# EAGLE design microcontroller_r0 (EAGLE 6.5.0)
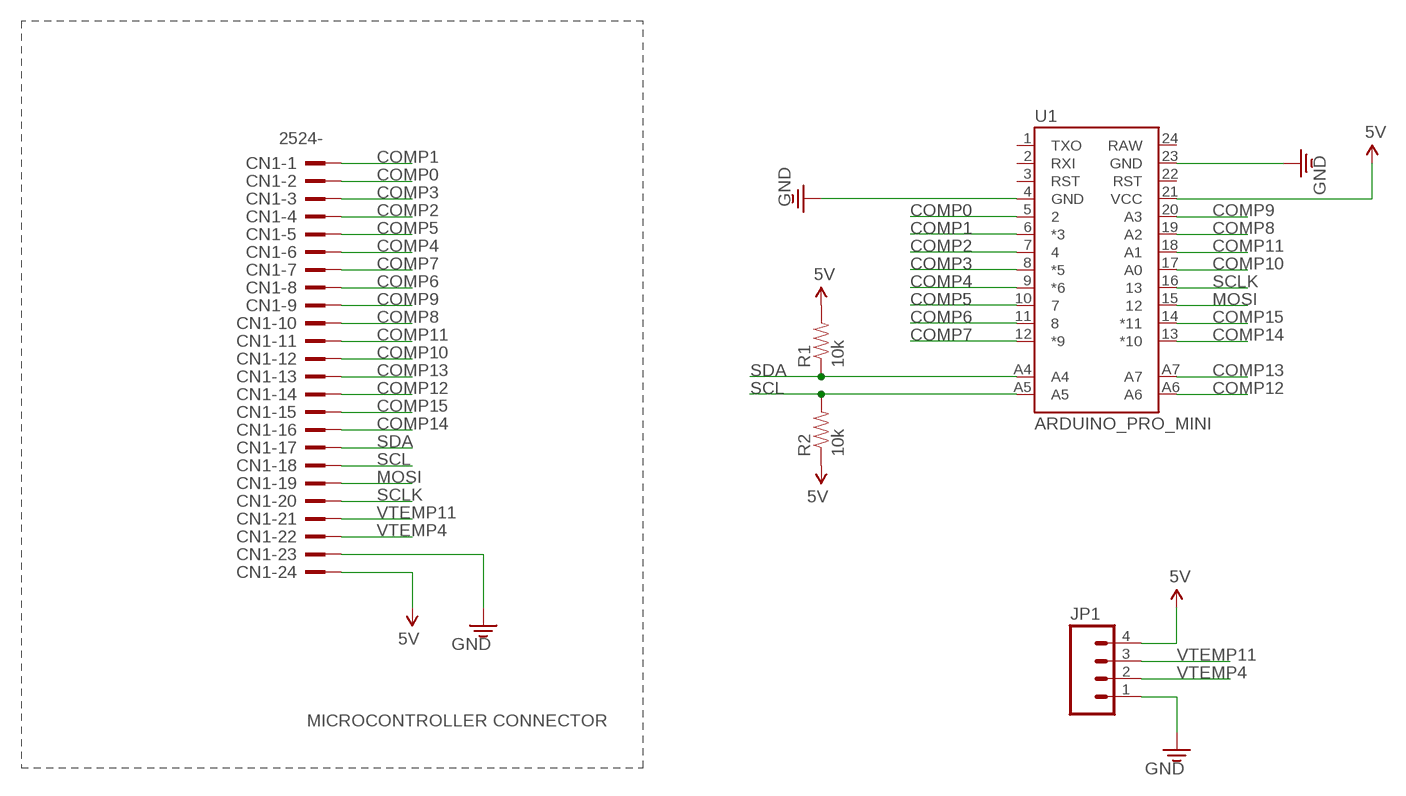
[diagram p0: schematic, sheet 1]

## Parts
CN1  2524-  [PAK100/2500-24]
JP1  M04LOCK  [1X04_LOCK]
R1  10k  RESISTOR0603  [0603]
R2  10k  RESISTOR0603  [0603]
U1  ARDUINO_PRO_MINI  [ARDUINO_PRO_MINI]

## Nets
5V: CN1.24 JP1.4 R1.2 R2.1 U1.21(VCC)
COMP0: CN1.2 U1.5
COMP1: CN1.1 U1.6(*3)
COMP2: CN1.4 U1.7
COMP3: CN1.3 U1.8(*5)
COMP4: CN1.6 U1.9(*6)
COMP5: CN1.5 U1.10
COMP6: CN1.8 U1.11
COMP7: CN1.7 U1.12(*9)
COMP8: CN1.10 U1.19(A2)
COMP9: CN1.9 U1.20(A3)
COMP10: CN1.12 U1.17(A0)
COMP11: CN1.11 U1.18(A1)
COMP12: CN1.14 U1.A6
COMP13: CN1.13 U1.A7
COMP14: CN1.16 U1.13(*10)
COMP15: CN1.15 U1.14(*11)
GND: CN1.23 JP1.1 U1.4(GND) U1.23(GND)
MOSI: CN1.19 U1.15
SCL: CN1.18 R2.2 U1.A5
SCLK: CN1.20 U1.16
SDA: CN1.17 R1.1 U1.A4
VTEMP4: CN1.22 JP1.2
VTEMP11: CN1.21 JP1.3
Unconnected: U1.1(TXO) U1.2(RXI) U1.3(RST) U1.22(RST) U1.24(RAW)

## Notes on the sheet
- MICROCONTROLLER CONNECTOR

## Library data of the parts
CN1 = con-3m:2524-: 3M (TM) Pak 100 4-Wall Header Source: 3M; OC_FARNELL: unknown; OC_NEWARK: unknown
JP1 = SparkFun-Connectors:M04: Header 4 Standard 4-pin 0.1" header. Use with straight break away headers (SKU : PRT-00116), right angle break away headers (PRT-00553), swiss pins (PRT-00743), machine pins (PRT-00117), and female headers (PRT-00115). Molex polarized connector foot print use with SKU : PRT-08231 with associated crimp pins and housings. 1MM SMD Version SKU: PRT-10208
R1 R2 = openct:RESISTOR: Resistor Basic schematic elements and footprints for 0603, 1206, and PTH 1/10th watt (small) resistors.
U1 = SparkFun-Boards:ARDUINO_PRO_MINI

## Board
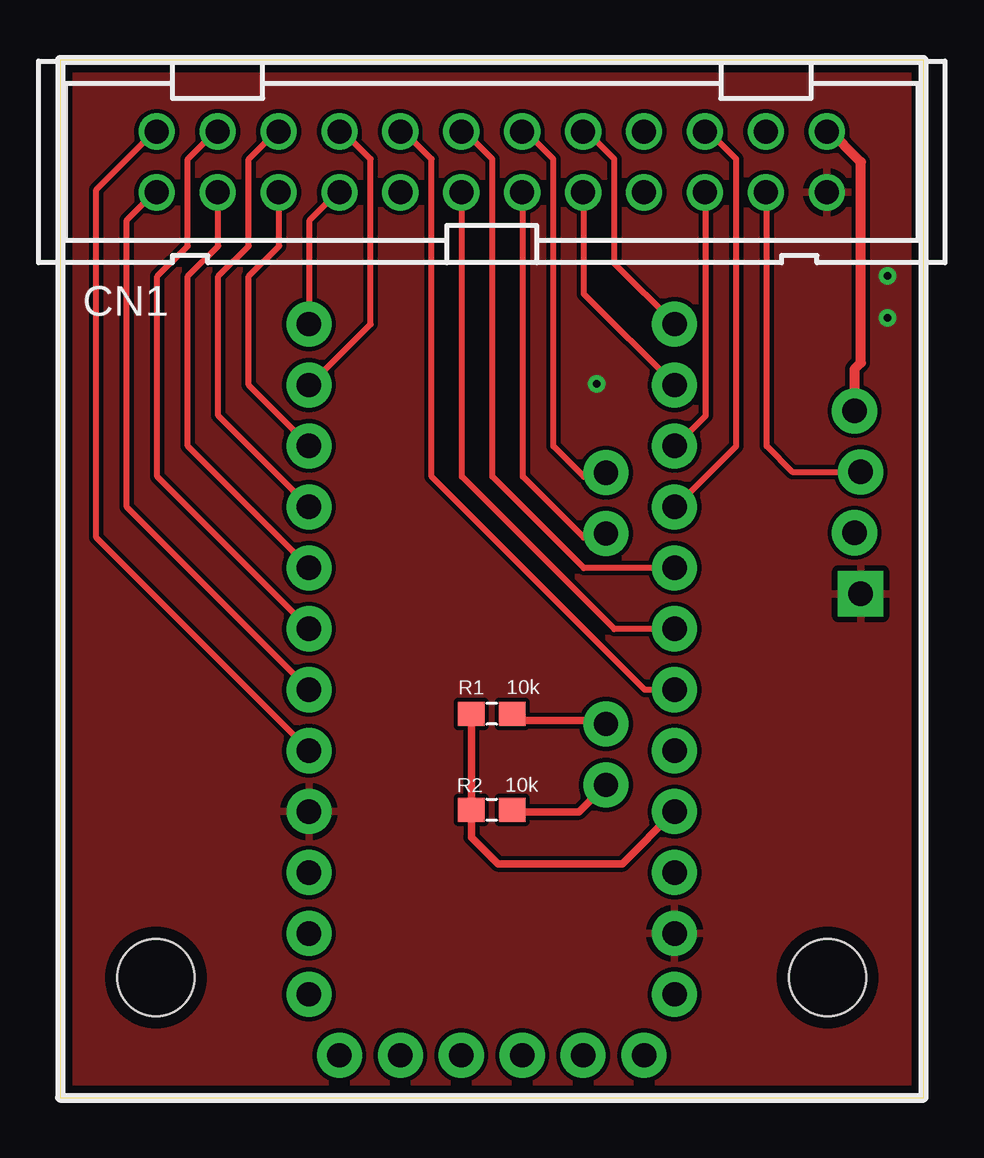
[diagram p1: board, top side]
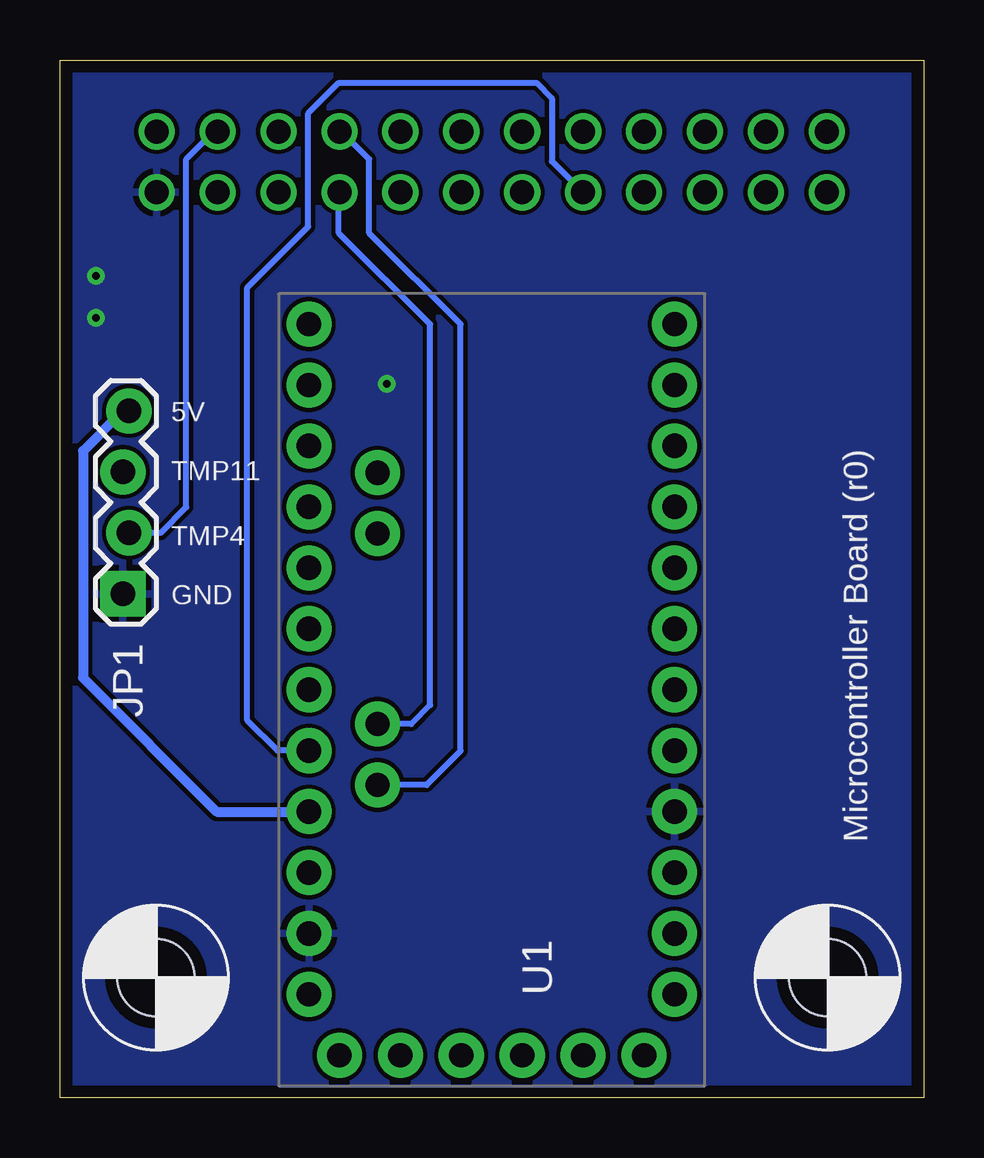
[diagram p2: board, bottom side, seen from below]

Size 36 x 43.25 mm. Coordinates in mm from the lower left corner, seen from the top.
Outline: 0,43.25 0,0 36,0 36,43.25 0,43.25
Copper layers (1*16): Top 0.035mm / dielectric 1.5mm / Bottom 0.035mm
Design rules "default *": minimum track width 10mil, minimum drill 13mil, track to track 7mil, track to pad 8mil, pad to pad 8mil, via to via 8mil, smd to smd 8mil, copper to edge 20mil, drill to drill 8mil, minimum pad ring 10mil, minimum via ring 8mil, stop-mask expansion 4mil, vias tented up to drill 0mil, thermal gap 10mil

### Footprints (pad centres in the part's own frame; a part is rotated, then mirrored left to right if it is on the bottom)
PAK100/2500-24 = drill 1 pad 1.422: 1 -13.97,-1.27; 2 -13.97,1.27; 3 -11.43,-1.27; 4 -11.43,1.27; 5 -8.89,-1.27; 6 -8.89,1.27; 7 -6.35,-1.27; 8 -6.35,1.27; 9 -3.81,-1.27; 10 -3.81,1.27; 11 -1.27,-1.27; 12 -1.27,1.27; 13 1.27,-1.27; 14 1.27,1.27; 15 3.81,-1.27; 16 3.81,1.27; 17 6.35,-1.27; 18 6.35,1.27; 19 8.89,-1.27; 20 8.89,1.27; 21 11.43,-1.27; 22 11.43,1.27; 23 13.97,-1.27; 24 13.97,1.27
1X04_LOCK = drill 1.016 pad 1.88 square: 1 0,0.127 | drill 1.016 pad 1.88: 2 2.54,-0.127; 3 5.08,0.127; 4 7.62,-0.127
0603 = smd 1.1 x 1: 1 -0.85,0; 2 0.85,0
ARDUINO_PRO_MINI = drill 1.016 pad 1.88: 1 -7.62,12.7; 2 -7.62,10.16; 3 -7.62,7.62; 4 -7.62,5.08; 5 -7.62,2.54; 6 -7.62,0; 7 -7.62,-2.54; 8 -7.62,-5.08; 9 -7.62,-7.62; 10 -7.62,-10.16; 11 -7.62,-12.7; 12 -7.62,-15.24; 13 7.62,-15.24; 14 7.62,-12.7; 15 7.62,-10.16; 16 7.62,-7.62; 17 7.62,-5.08; 18 7.62,-2.54; 19 7.62,0; 20 7.62,2.54; 21 7.62,5.08; 22 7.62,7.62; 23 7.62,10.16; 24 7.62,12.7; A4 4.763,1.429; A5 4.763,3.969; A6 4.763,-9.049; A7 4.763,-6.509; BLK -6.35,15.24; GND -3.81,15.24; GRN 6.35,15.24; RXI 1.27,15.24; TXO 3.81,15.24; VCC -1.27,15.24
MOUNT-M3 = hole 3.2: 0,0

### Placement (x,y rotation side)
CN1  18,39 0 top
JP1  33.25,21 90 bottom
R1  18,16 180 top
R2  18,12 0 top
U1  18,17 180 bottom
U$35  [MOUNT-M3]  32,5 0 bottom
U$36  [MOUNT-M3]  4,5 0 bottom

### Tracks (layer width: path | path; a pad name or v marks a point on that pad's centre or on a via)
5V
  Top 0.254: 32,40.39 CN1.24
  Top 0.305: R1.2 R2.1 17.15,10.85 18.25,9.75 23.45,9.75 U1.21
  Top 0.406: 32,40.39 33.4,39 33.4,30.63 33.12,30.36 JP1.4
  Bottom 0.254: 25.65,11.91 U1.21
  Bottom 0.406: 25.65,11.91 29.46,11.91 35.04,17.49 35.04,26.96 33.38,28.62 JP1.4
COMP0
  Top 0.254: CN1.2 4.06,40.39 1.52,37.85 1.52,23.34 10.41,14.45 U1.5
COMP1
  Top 0.254: CN1.1 4.06,37.85 2.79,36.58 2.79,24.61 10.41,16.99 U1.6
COMP2
  Top 0.254: CN1.4 6.6,40.39 5.33,39.12 5.33,35.5 4.06,34.23 4.06,25.88 10.41,19.53 U1.7
COMP3
  Top 0.254: CN1.3 6.6,37.85 6.6,35.5 5.33,34.23 5.33,27.15 10.41,22.07 U1.8
COMP4
  Top 0.254: CN1.6 9.14,40.39 7.87,39.12 7.87,35.5 6.6,34.23 6.6,28.42 10.41,24.61 U1.9
COMP5
  Top 0.254: CN1.5 9.14,37.85 9.14,35.5 7.87,34.23 7.87,29.69 10.41,27.15 U1.10
COMP6
  Top 0.254: CN1.8 11.68,40.39 12.95,39.12 12.95,32.23 10.41,29.69 U1.11
COMP7
  Top 0.254: CN1.7 11.68,37.85 10.41,36.58 10.41,32.23 U1.12
COMP8
  Top 0.254: CN1.10 14.22,40.39 15.49,39.12 15.49,25.88 24.38,16.99 25.65,16.99 U1.19
COMP9
  Bottom 0.254: U1.20 26.93,14.46 28.19,15.72 28.19,33.77 25.65,36.31 25.65,41.03 24.38,42.3 16.12,42.3 15.49,41.66 15.49,39.03 CN1.9
COMP10
  Top 0.254: CN1.12 16.76,40.39 18.03,39.12 18.03,25.88 21.84,22.07 25.65,22.07 U1.17
COMP11
  Top 0.254: CN1.11 16.76,37.85 16.76,25.88 23.11,19.53 25.65,19.53 U1.18
COMP12
  Top 0.254: CN1.14 19.3,40.39 20.57,39.12 20.57,27.15 21.84,25.88 U1.A6
COMP13
  Top 0.254: CN1.13 19.3,37.85 19.3,25.88 21.84,23.34 U1.A7
COMP14
  Top 0.254: CN1.16 21.84,40.39 23.11,39.12 23.11,34.77 25.65,32.23 U1.13
COMP15
  Top 0.254: CN1.15 21.84,37.85 21.84,33.5 25.65,29.69 U1.14
GND  (via drill 0.33)
  other vias: 34.5,34.25 34.5,32.5 22.38,29.75
  pour Top: 0,43.25 0,0 36,0 36,43.25
  pour Bottom: 0,43.25 0,0 36,0 36,43.25
MOSI
  Top 0.254: CN1.19 26.92,37.85 26.92,28.42 25.65,27.15 U1.15
SCL
  Top 0.254: 19.3,11.91 R2.2
  Top 0.305: 19.3,11.91 21.64,11.91 U1.A5
  Bottom 0.254: CN1.18 24.38,40.39 23.11,39.12 23.11,36.04 19.3,32.23 19.3,14.45 20.72,13.03 U1.A5
SCLK
  Top 0.254: CN1.20 26.92,40.39 28.19,39.12 28.19,27.15 25.65,24.61 U1.16
SDA
  Top 0.254: 19.3,15.72 R1.1
  Top 0.305: 19.3,15.72 22.61,15.72 U1.A4
  Bottom 0.254: CN1.17 24.38,37.85 24.38,36.04 20.57,32.23 20.57,16.35 21.35,15.57 U1.A4
VTEMP4
  Bottom 0.254: CN1.22 29.46,40.39 30.73,39.12 30.73,24.61 31.8,23.54 JP1.2
VTEMP11
  Top 0.254: CN1.21 29.46,37.85 29.46,27.15 30.53,26.08 JP1.3

### Text on the board
bPlace: 5V | TMP11 | TMP4 | GND | Microcontroller Board (r0)